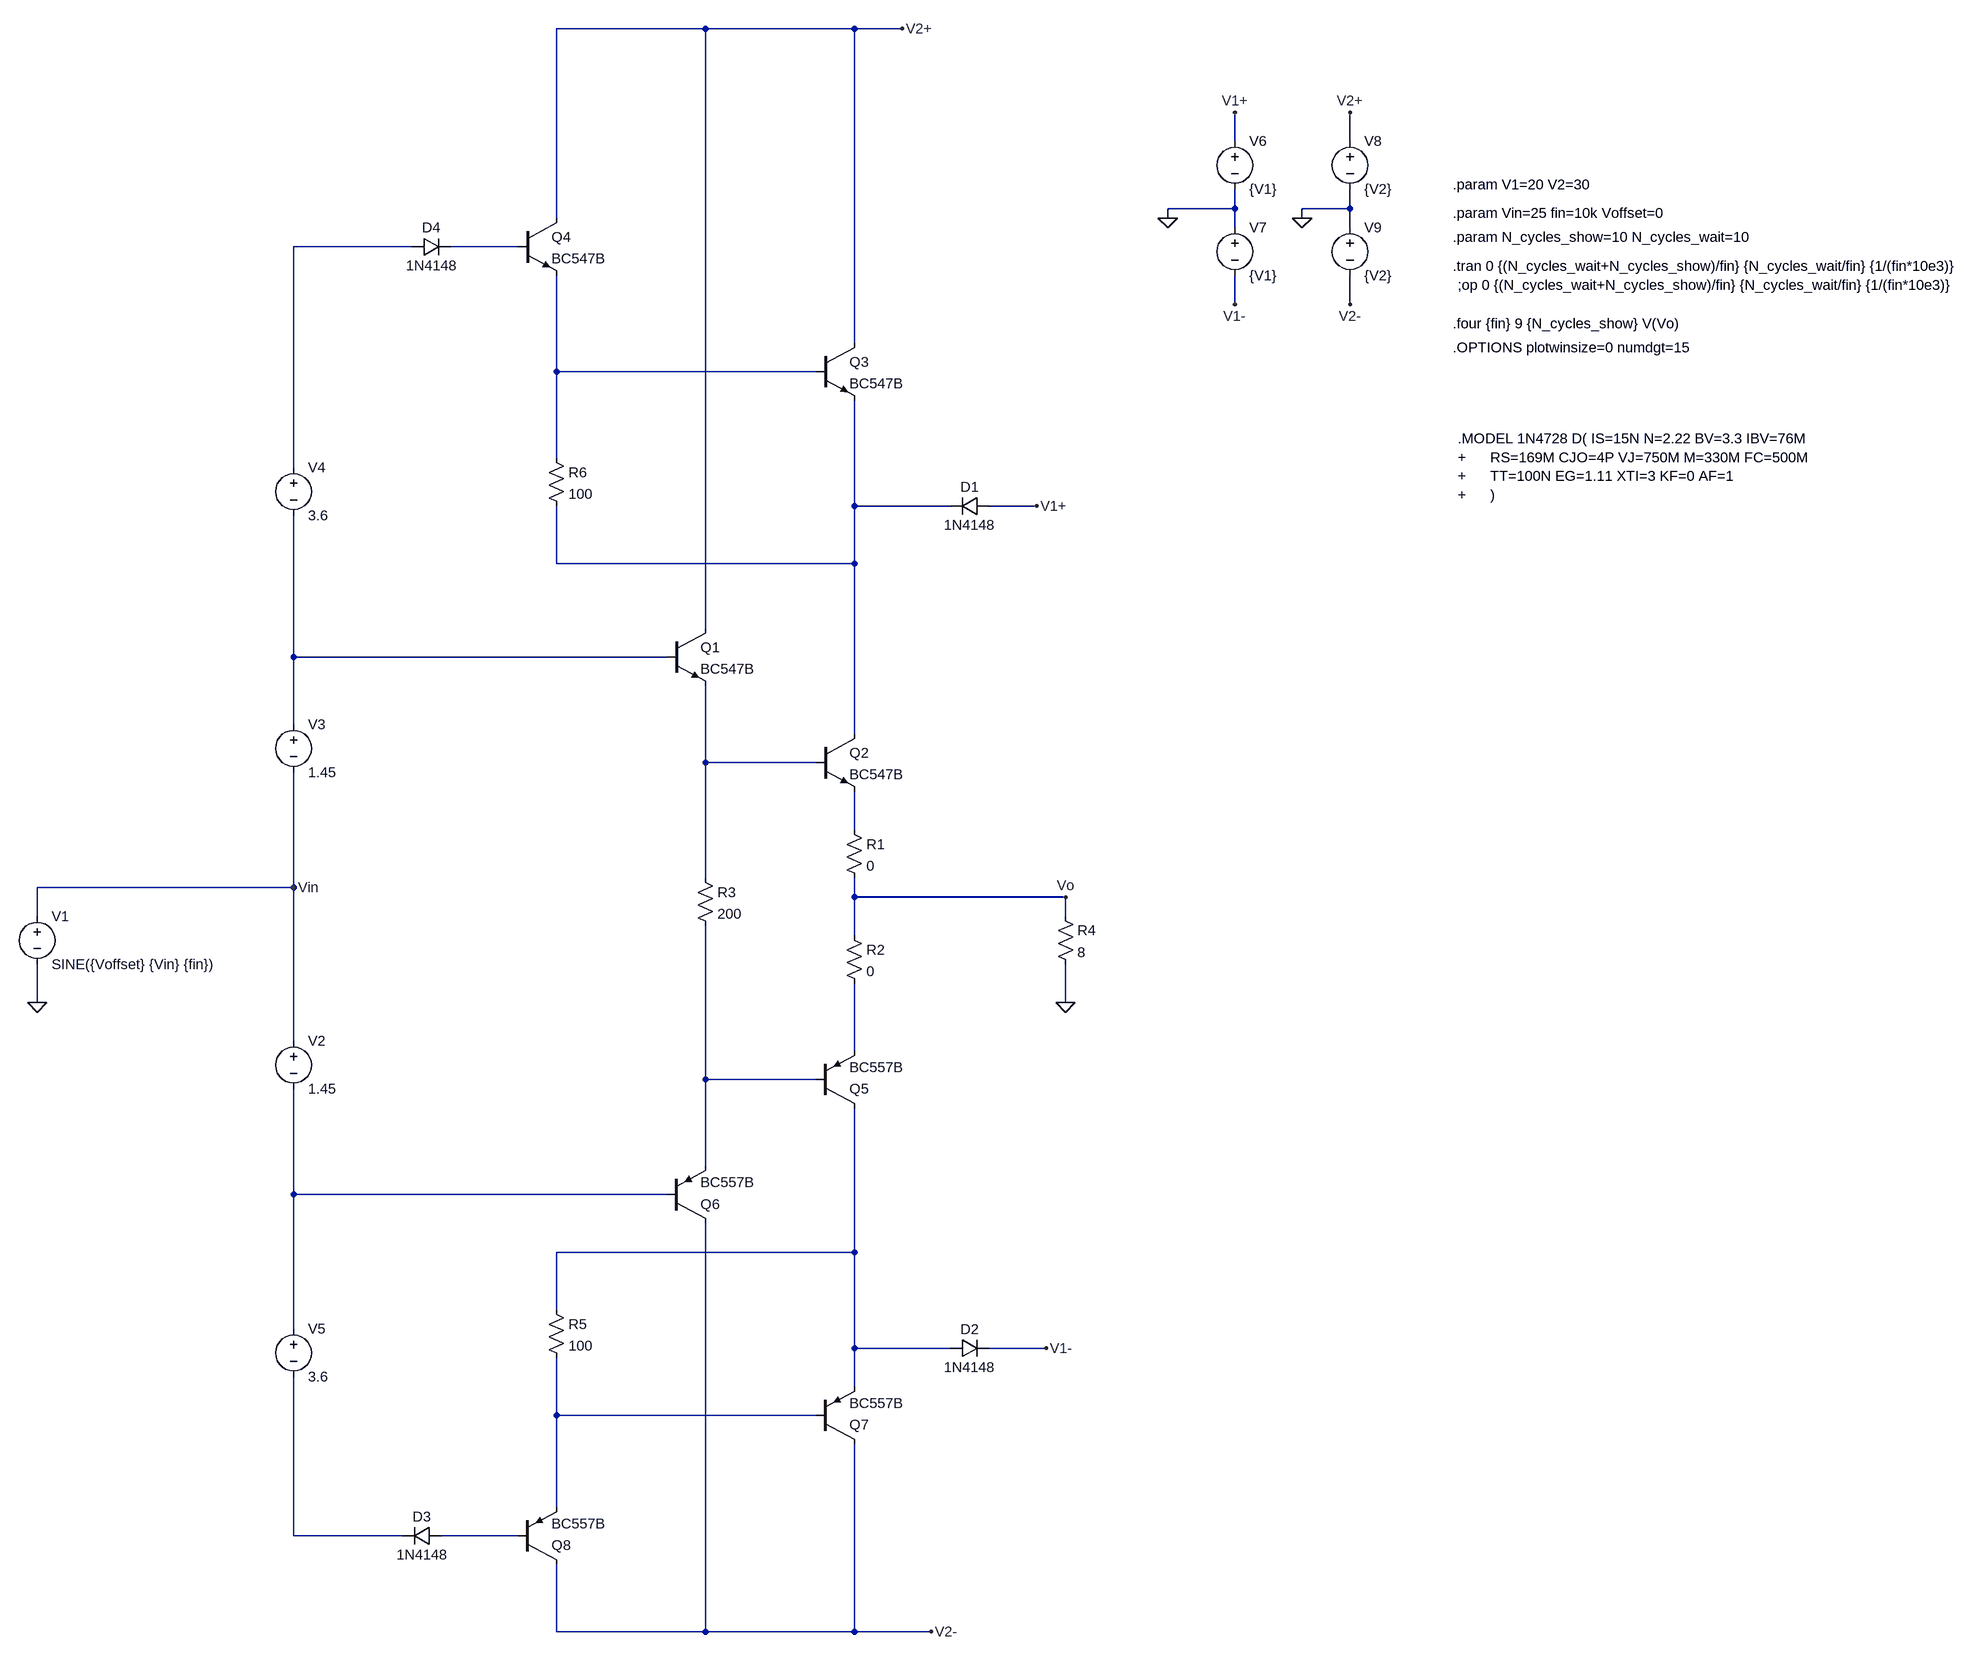
[diagram p0: schematic generadores.asc]
generadores.asc, the LTspice schematic file:
Version 4
SHEET 1 2768 1996
WIRE 176 -1040 -144 -1040
WIRE 496 -1040 176 -1040
WIRE 576 -1040 496 -1040
WIRE 1312 -832 1312 -880
WIRE 1504 -832 1504 -880
WIRE 1312 -720 1312 -752
WIRE 1312 -720 1200 -720
WIRE 1504 -720 1504 -752
WIRE 1504 -720 1424 -720
WIRE -144 -704 -144 -1040
WIRE 1200 -704 1200 -720
WIRE 1424 -704 1424 -720
WIRE 1312 -688 1312 -720
WIRE 1504 -688 1504 -720
WIRE -416 -656 -624 -656
WIRE -208 -656 -352 -656
WIRE 1312 -560 1312 -608
WIRE 1504 -560 1504 -608
WIRE 496 -496 496 -1040
WIRE -144 -448 -144 -608
WIRE 432 -448 -144 -448
WIRE -144 -304 -144 -448
WIRE -624 -288 -624 -656
WIRE 496 -224 496 -400
WIRE 656 -224 496 -224
WIRE 800 -224 720 -224
WIRE -144 -128 -144 -224
WIRE 496 -128 496 -224
WIRE 496 -128 -144 -128
WIRE 176 0 176 -1040
WIRE -624 48 -624 -208
WIRE 112 48 -624 48
WIRE -624 160 -624 48
WIRE 496 176 496 -128
WIRE 176 224 176 96
WIRE 432 224 176 224
WIRE 496 336 496 272
WIRE 176 416 176 224
WIRE -624 432 -624 240
WIRE -624 432 -1088 432
WIRE 496 448 496 416
WIRE 848 448 496 448
WIRE -1088 480 -1088 432
WIRE 848 480 848 448
WIRE 496 512 496 448
WIRE -1088 624 -1088 560
WIRE 848 624 848 560
WIRE -624 688 -624 432
WIRE 496 704 496 592
WIRE 176 752 176 496
WIRE 432 752 176 752
WIRE 176 896 176 752
WIRE -624 944 -624 768
WIRE 112 944 -624 944
WIRE 496 1040 496 800
WIRE 496 1040 -144 1040
WIRE -144 1136 -144 1040
WIRE -624 1168 -624 944
WIRE 496 1200 496 1040
WIRE 656 1200 496 1200
WIRE 816 1200 720 1200
WIRE 496 1264 496 1200
WIRE -144 1312 -144 1216
WIRE 432 1312 -144 1312
WIRE -144 1488 -144 1312
WIRE -624 1536 -624 1248
WIRE -432 1536 -624 1536
WIRE -208 1536 -368 1536
WIRE -144 1936 -144 1584
WIRE 176 1936 176 992
WIRE 176 1936 -144 1936
WIRE 496 1936 496 1360
WIRE 496 1936 176 1936
WIRE 624 1936 496 1936
FLAG 848 624 0
FLAG 800 -224 V1+
FLAG 816 1200 V1-
FLAG 624 1936 V2-
FLAG 576 -1040 V2+
FLAG 1200 -704 0
FLAG 1424 -704 0
FLAG 1312 -560 V1-
FLAG 1312 -880 V1+
FLAG 1504 -880 V2+
FLAG 1504 -560 V2-
FLAG 848 448 Vo
FLAG -1088 624 0
FLAG -624 432 Vin
DATAFLAG 624 448 ""
DATAFLAG 0 48 ""
DATAFLAG -16 944 ""
DATAFLAG 176 224 ""
DATAFLAG -64 1936 ""
DATAFLAG -128 1312 ""
SYMBOL npn 112 0 R0
SYMATTR InstName Q1
SYMATTR Value BC547B
SYMBOL npn 432 176 R0
SYMATTR InstName Q2
SYMATTR Value BC547B
SYMBOL npn 432 -496 R0
SYMATTR InstName Q3
SYMATTR Value BC547B
SYMBOL npn -208 -704 R0
SYMATTR InstName Q4
SYMATTR Value BC547B
SYMBOL res 480 320 R0
SYMATTR InstName R1
SYMATTR Value 0
SYMBOL res 480 496 R0
SYMATTR InstName R2
SYMATTR Value 0
SYMBOL pnp 432 800 M180
SYMATTR InstName Q5
SYMATTR Value BC557B
SYMBOL pnp 112 992 M180
SYMATTR InstName Q6
SYMATTR Value BC557B
SYMBOL pnp 432 1360 M180
SYMATTR InstName Q7
SYMATTR Value BC557B
SYMBOL pnp -208 1584 M180
SYMATTR InstName Q8
SYMATTR Value BC557B
SYMBOL res 160 400 R0
SYMATTR InstName R3
SYMATTR Value 200
SYMBOL res 832 464 R0
SYMATTR InstName R4
SYMATTR Value 8
SYMBOL res -160 1120 R0
SYMATTR InstName R5
SYMATTR Value 100
SYMBOL res -160 -320 R0
SYMATTR InstName R6
SYMATTR Value 100
SYMBOL diode 720 -240 R90
WINDOW 0 0 32 VBottom 2
WINDOW 3 32 32 VTop 2
SYMATTR InstName D1
SYMATTR Value 1N4148
SYMBOL diode 656 1216 R270
WINDOW 0 32 32 VTop 2
WINDOW 3 0 32 VBottom 2
SYMATTR InstName D2
SYMATTR Value 1N4148
SYMBOL diode -368 1520 R90
WINDOW 0 0 32 VBottom 2
WINDOW 3 32 32 VTop 2
SYMATTR InstName D3
SYMATTR Value 1N4148
SYMBOL diode -416 -640 R270
WINDOW 0 32 32 VTop 2
WINDOW 3 0 32 VBottom 2
SYMATTR InstName D4
SYMATTR Value 1N4148
SYMBOL voltage 1312 -848 R0
WINDOW 123 0 0 Left 0
WINDOW 39 0 0 Left 0
SYMATTR InstName V6
SYMATTR Value {V1}
SYMBOL voltage 1312 -704 R0
WINDOW 123 0 0 Left 0
WINDOW 39 0 0 Left 0
SYMATTR InstName V7
SYMATTR Value {V1}
SYMBOL voltage 1504 -848 R0
WINDOW 123 0 0 Left 0
WINDOW 39 0 0 Left 0
SYMATTR InstName V8
SYMATTR Value {V2}
SYMBOL voltage 1504 -704 R0
WINDOW 123 0 0 Left 0
WINDOW 39 0 0 Left 0
SYMATTR InstName V9
SYMATTR Value {V2}
SYMBOL voltage -1088 464 R0
WINDOW 123 0 0 Left 0
WINDOW 39 0 0 Left 0
SYMATTR InstName V1
SYMATTR Value SINE({Voffset} {Vin} {fin})
SYMBOL voltage -624 672 R0
WINDOW 123 0 0 Left 0
WINDOW 39 0 0 Left 0
SYMATTR InstName V2
SYMATTR Value 1.45
SYMBOL voltage -624 144 R0
WINDOW 123 0 0 Left 0
WINDOW 39 0 0 Left 0
SYMATTR InstName V3
SYMATTR Value 1.45
SYMBOL voltage -624 -304 R0
WINDOW 123 0 0 Left 0
WINDOW 39 0 0 Left 0
SYMATTR InstName V4
SYMATTR Value 3.6
SYMBOL voltage -624 1152 R0
WINDOW 123 0 0 Left 0
WINDOW 39 0 0 Left 0
SYMATTR InstName V5
SYMATTR Value 3.6
TEXT 1792 -760 Left 2 !.param V1=20 V2=30
TEXT 1792 -712 Left 2 !.param Vin=25 fin=10k Voffset=0
TEXT 1792 -624 Left 2 !.tran 0 {(N_cycles_wait+N_cycles_show)/fin} {N_cycles_wait/fin} {1/(fin*10e3)}
TEXT 1792 -672 Left 2 !.param N_cycles_show=10 N_cycles_wait=10
TEXT 1800 -592 Left 2 !;op 0 {(N_cycles_wait+N_cycles_show)/fin} {N_cycles_wait/fin} {1/(fin*10e3)}
TEXT 1792 -528 Left 2 !.four {fin} 9 {N_cycles_show} V(Vo)
TEXT 1792 -488 Left 2 !.OPTIONS plotwinsize=0 numdgt=15
TEXT 1800 -336 Left 2 !.MODEL 1N4728 D( IS=15N N=2.22 BV=3.3 IBV=76M \n+      RS=169M CJO=4P VJ=750M M=330M FC=500M \n+      TT=100N EG=1.11 XTI=3 KF=0 AF=1 \n+      )

The netlist it stands for:
* generadores.asc
Q1 V2+ N005 N006 0 BC547B
Q2 N004 N006 N007 0 BC547B
Q3 V2+ N003 N004 0 BC547B
Q4 V2+ N002 N003 0 BC547B
R1 N007 Vo 0
R2 Vo N008 0
Q5 N011 N009 N008 0 BC557B
Q6 V2- N010 N009 0 BC557B
Q7 V2- N012 N011 0 BC557B
Q8 V2- N014 N012 0 BC557B
R3 N006 N009 200
R4 Vo 0 8
R5 N011 N012 100
R6 N003 N004 100
D1 V1+ N004 1N4148
D2 N011 V1- 1N4148
D3 N014 N013 1N4148
D4 N001 N002 1N4148
V6 V1+ 0 {V1}
V7 0 V1- {V1}
V8 V2+ 0 {V2}
V9 0 V2- {V2}
V1 Vin 0 SINE({Voffset} {Vin} {fin})
V2 Vin N010 1.45
V3 N005 Vin 1.45
V4 N001 N005 3.6
V5 N010 N013 3.6
.model D D
.lib standard.dio
.model NPN NPN
.model PNP PNP
.lib standard.bjt
.param V1=20 V2=30
.param Vin=25 fin=10k Voffset=0
.tran 0 {(N_cycles_wait+N_cycles_show)/fin} {N_cycles_wait/fin} {1/(fin*10e3)}
.param N_cycles_show=10 N_cycles_wait=10
;op 0 {(N_cycles_wait+N_cycles_show)/fin} {N_cycles_wait/fin} {1/(fin*10e3)}
.four {fin} 9 {N_cycles_show} V(Vo)
.OPTIONS plotwinsize=0 numdgt=15
.MODEL 1N4728 D( IS=15N N=2.22 BV=3.3 IBV=76M
+      RS=169M CJO=4P VJ=750M M=330M FC=500M
+      TT=100N EG=1.11 XTI=3 KF=0 AF=1
+      )
.backanno
.end